# Altium schematic sheet Main MCU and peripheral.SchDoc
size C
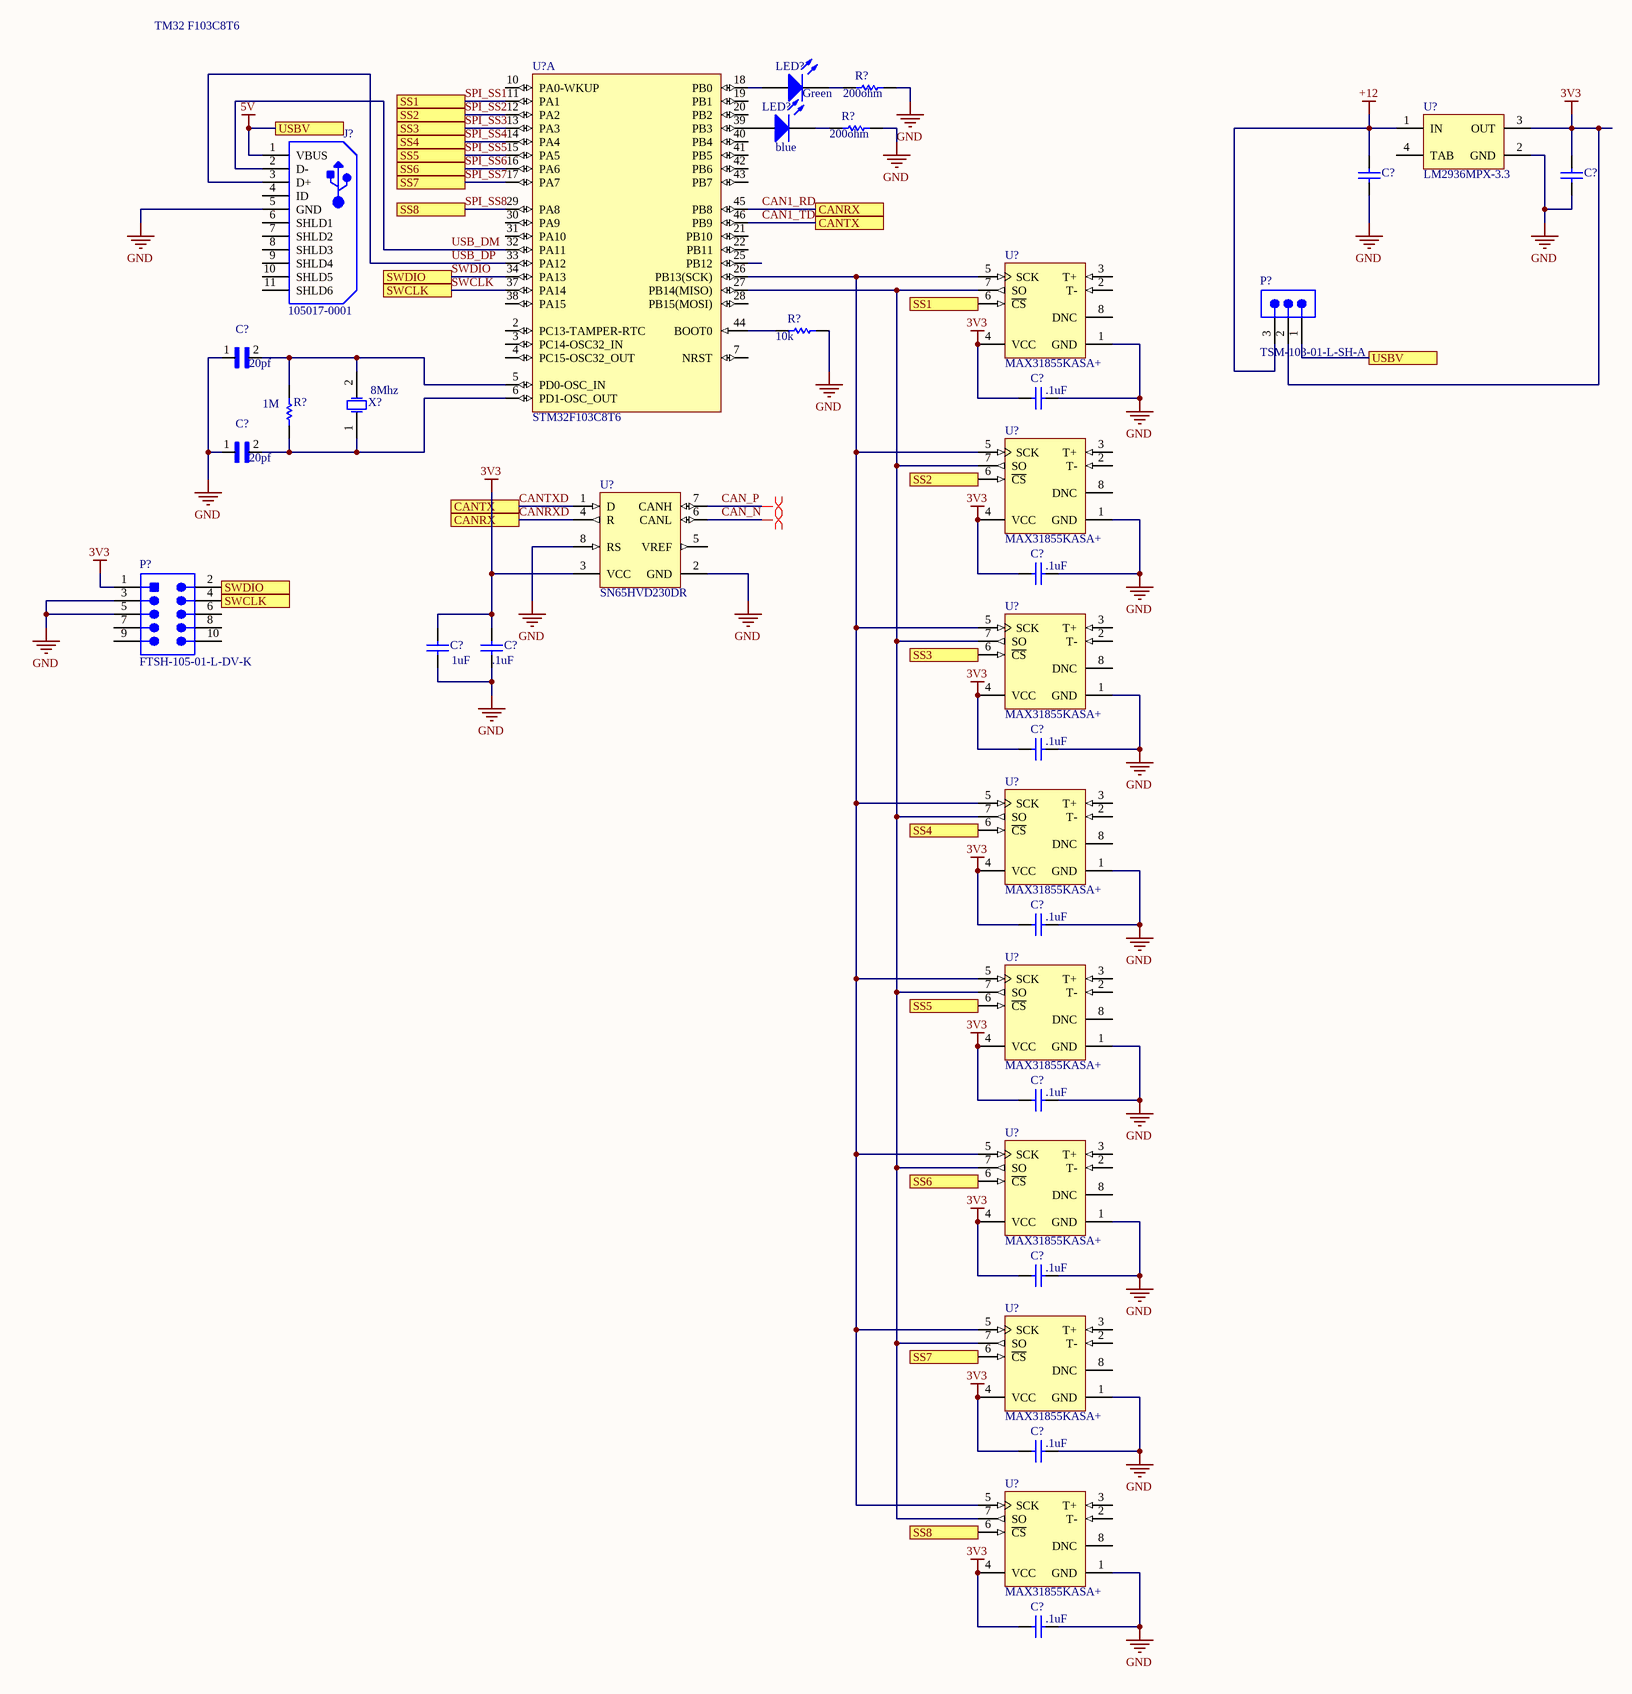
[diagram p0: Main MCU and peripheral.SchDoc]

## Parts
(Parts that share a designator on the sheet are numbered #1, #2 ... from top to bottom, then left to right.)
C?#1  C0603C104M4RACTU  [CAPC1608X87X35ML15T15]  (value not drawn)
C?#2  C0805C106K4PACTU  [CAPC2013X140X50LL20T25]  (value not drawn)
C?#3  06036A180JAT2A  [*CAPC1608X90N]  (value not drawn)
C?#4  C0603C104K9PAC7867  [CAPC1608X90X35ML10T15]  (value not drawn)
C?#5  06036A180JAT2A  [*CAPC1608X90N]  (value not drawn)
C?#6  C0603C104K9PAC7867  [CAPC1608X90X35ML10T15]  (value not drawn)
C?#7  CAP 1uF 6.3V 0805(2012)  [CAPC0805(2012)145_N]  (value not drawn)
C?#8  CAP 100nF 6.3V 0805(2012)  [CAPC0805(2012)100_N]  (value not drawn)
C?#9  C0603C104K9PAC7867  [CAPC1608X90X35ML10T15]  (value not drawn)
C?#10  C0603C104K9PAC7867  [CAPC1608X90X35ML10T15]  (value not drawn)
C?#11  C0603C104K9PAC7867  [CAPC1608X90X35ML10T15]  (value not drawn)
C?#12  C0603C104K9PAC7867  [CAPC1608X90X35ML10T15]  (value not drawn)
C?#13  C0603C104K9PAC7867  [CAPC1608X90X35ML10T15]  (value not drawn)
C?#14  C0603C104K9PAC7867  [CAPC1608X90X35ML10T15]  (value not drawn)
J?  105017-0001  [USB-MICRO-B_V]
LED?#1  150120GS75000  [1206_A]  (value not drawn)
LED?#2  150120BS75000  [1206_A]  (value not drawn)
P?#1  TSM-103-01-L-SH-A  [SMTC-TSM-103-01-X-SH-A]
P?#2  FTSH-105-01-L-DV-K  [SMTC-FTSH-105-01-L-DV-K_V]
R?#1  AC0603FR-07200RL  [RESC1608X55X25ML10T15]  (value not drawn)
R?#2  AC0603FR-07200RL  [RESC1608X55X25ML10T15]  (value not drawn)
R?#3  RC0805FR-0710KL  [RESC2013X60X35NL10T20]  (value not drawn)
R?#4  RC0603FR-071ML  [RESC1608X55X25LL10T15]  (value not drawn)
U?#1  STM32F103C8T6  [STM-LQFP48_L]  (part A of 2)
U?#2  LM2936MPX-3.3  [MP04A_N]
U?#3  MAX31855KASA+  [MAXM-S8+4_M]
U?#4  MAX31855KASA+  [MAXM-S8+4_M]
U?#5  SN65HVD230DR  [D0008A_L]
U?#6  MAX31855KASA+  [MAXM-S8+4_M]
U?#7  MAX31855KASA+  [MAXM-S8+4_M]
U?#8  MAX31855KASA+  [MAXM-S8+4_M]
U?#9  MAX31855KASA+  [MAXM-S8+4_M]
U?#10  MAX31855KASA+  [MAXM-S8+4_M]
U?#11  MAX31855KASA+  [MAXM-S8+4_M]
X?  ABM3-8.000MHZ-D2Y-T  [ABRA-ABM3-2_V]  (value not drawn)

## Ports
CANRX, CANTX, SS1, SS2, SS3, SS4, SS5, SS6, SS7, SS8, SWCLK, SWDIO, USBV

## Nets
3V3: C?#2.2 C?#4.1 C?#6.1 C?#7.2 C?#8.2 C?#9.1 C?#10.1 C?#11.1 C?#12.1 C?#13.1 C?#14.1 P?#1.2 P?#2.1 U?#2.3(OUT) U?#3.4(VCC) U?#4.4(VCC) U?#5.3(VCC) U?#6.4(VCC) U?#7.4(VCC) U?#8.4(VCC) U?#9.4(VCC) U?#10.4(VCC) U?#11.4(VCC)
5V: J?.1(VBUS) P?#1.1 ; port USBV
+12: C?#1.2 P?#1.3 U?#2.1(IN)
GND: C?#1.1 C?#2.1 C?#3.1 C?#4.2 C?#5.1 C?#6.2 C?#7.1 C?#8.1 C?#9.2 C?#10.2 C?#11.2 C?#12.2 C?#13.2 C?#14.2 J?.5(GND) P?#2.3 P?#2.5 R?#1.2 R?#2.2 R?#3.2 U?#2.2(GND) U?#3.1(GND) U?#4.1(GND) U?#5.2(GND) U?#5.8(RS) U?#6.1(GND) U?#7.1(GND) U?#8.1(GND) U?#9.1(GND) U?#10.1(GND) U?#11.1(GND)
CAN1_RD: U?#1.45(PB8) U?#5.4(R) ; port CANRX  [also labelled CANRXD]
CAN1_TD: U?#1.46(PB9) U?#5.1(D) ; port CANTX  [also labelled CANTXD]
CAN_N: U?#5.6(CANL)
CAN_P: U?#5.7(CANH)
SPI_SS1: U?#1.11(PA1) U?#3.6(~{CS}) ; port SS1
SPI_SS2: U?#1.12(PA2) U?#4.6(~{CS}) ; port SS2
SPI_SS3: U?#1.13(PA3) U?#6.6(~{CS}) ; port SS3
SPI_SS4: U?#1.14(PA4) U?#7.6(~{CS}) ; port SS4
SPI_SS5: U?#1.15(PA5) U?#8.6(~{CS}) ; port SS5
SPI_SS6: U?#1.16(PA6) U?#9.6(~{CS}) ; port SS6
SPI_SS7: U?#1.17(PA7) U?#10.6(~{CS}) ; port SS7
SPI_SS8: U?#1.29(PA8) U?#11.6(~{CS}) ; port SS8
SWCLK: P?#2.4 U?#1.37(PA14) ; port SWCLK
SWDIO: P?#2.2 U?#1.34(PA13) ; port SWDIO
USB_DM: J?.2(D-) U?#1.32(PA11)
USB_DP: J?.3(D+) U?#1.33(PA12)
NetC?#3_2: C?#3.2 R?#4.2 U?#1.5(PD0-OSC_IN) X?.2(X2)
NetC?#5_2: C?#5.2 R?#4.1 U?#1.6(PD1-OSC_OUT) X?.1(X1)
NetLED?#1_1: LED?#1.1(K) R?#1.1
NetLED?#1_2: LED?#1.2(A) U?#1.18(PB0)
NetLED?#2_1: LED?#2.1(K) R?#2.1
NetLED?#2_2: LED?#2.2(A) U?#1.39(PB3)
NetR?#3_1: R?#3.1 U?#1.44(BOOT0)
NetU?#1_26: U?#1.26(PB13(SCK)) U?#3.5(SCK) U?#4.5(SCK) U?#6.5(SCK) U?#7.5(SCK) U?#8.5(SCK) U?#9.5(SCK) U?#10.5(SCK) U?#11.5(SCK)
NetU?#1_27: U?#1.27(PB14(MISO)) U?#3.7(SO) U?#4.7(SO) U?#6.7(SO) U?#7.7(SO) U?#8.7(SO) U?#9.7(SO) U?#10.7(SO) U?#11.7(SO)

Not connected (* = marked no-connect by the designer): J? 4(ID) 6(SHLD1) 7(SHLD2) 8(SHLD3) 9(SHLD4) 10(SHLD5) 11(SHLD6); P?#2 6 7 8 9 10; U?#1 2(PC13-TAMPER-RTC) 3(PC14-OSC32_IN) 4(PC15-OSC32_OUT) 7(NRST) 10(PA0-WKUP) 19(PB1) 20(PB2) 21(PB10) 22(PB11) 25(PB12) 28(PB15(MOSI)) 30(PA9) 31(PA10) 38(PA15) 40(PB4) 41(PB5) 42(PB6) 43(PB7); U?#2 4(TAB); U?#3 2(T-) 3(T+) 8(DNC); U?#4 2(T-) 3(T+) 8(DNC); U?#5 5(VREF); U?#6 2(T-) 3(T+) 8(DNC); U?#7 2(T-) 3(T+) 8(DNC); U?#8 2(T-) 3(T+) 8(DNC); U?#9 2(T-) 3(T+) 8(DNC); U?#10 2(T-) 3(T+) 8(DNC); U?#11 2(T-) 3(T+) 8(DNC)

## Layout directives
differential pair: CAN_N, CAN_P

## Notes on the sheet
- TM32 F103C8T6
- (near LED?#2) blue
- (near LED?#1) Green
- (near R?#2) 200ohm
- (near R?#1) 200ohm
- (near R?#3) 10k
- (near C?#3) 20pf
- (near R?#4) 1M
- (near X?) 8Mhz
- (near C?#4) .1uF
- (near C?#5) 20pf
- (near C?#6) .1uF
- (near C?#7) 1uF
- (near C?#8) .1uF
- (near C?#9) .1uF
- (near C?#10) .1uF
- (near C?#11) .1uF
- (near C?#12) .1uF
- (near C?#13) .1uF
- (near C?#14) .1uF
- Title
- Size:
- Date:
- File:
- C
- Number:
- Time:
- Revision:
- Sheet
- of

## Library data of the parts
C?#1 = CMP-2006-03067-1: .1uF, 16V; Manufacturer: Kemet; Part Number: C0603C104M4RACTU
C?#2 = CMP-2007-03242-1: 10uF, 16V; Manufacturer: Kemet; Part Number: C0805C106K4PACTU
C?#3 C?#5 = 06036A180JAT2A: / 18pF Â±5% 6.3V Ceramic Capacitor C0G, NP0 0603 _1608 Metric_ /; MF: AVX; SnapEDA_Link: https://www.snapeda.com/parts/06036A180JAT2A/AVX/view-part/606100/?ref=snap; MP: 06036A180JAT2A; Digi-Key_Part_Number: 478-11838-1-ND; Package: 1608 AVX; Digi-Key_Purchase_URL: https://www.digikey.com/product-detail/en/avx-corporation/06036A180JAT2A/478-11838-1-ND/8573474?utm_source=snapeda&utm_medium=aggregator&utm_campaign=symbol; Value: *
C?#4 C?#6 C?#9-C?#14 = CMP-2000-04945-1: Chip Capacitor, 22 pF, +/- 5%, 50 V, -55 to 125 degC, 0603 (1608 Metric), RoHS, Tape and Reel; Manufacturer: Murata; Capacitance: 22pF; Rated Voltage: 50V; Dielectric: C0G; Manufacturer URL: http://www.murata.com/; Datasheet Version: Jul-06; Package Reference: 603; Tolerance (%): ±5%; Case Size/Dimension: 0603; Package Description: 2-Pin Surface Mount Device, Body 1.6 x 0.8 mm; Datasheet URL: https://datasheet.ciiva.com/11786/0900766b807a1cab-11786398.pdf
C?#7 = CMP-1036-04731-1: CAP 1uF 6.3V ±10% 0805 (2012 Metric) Thickness 1.45mm SMD; Case-Metric: 2012; Case-EIA: 0805; Tolerance: Â±10%; Max Thickness: 1.45 mm; Technology: SMT; Value: 1uF; Rated Voltage: 6.3 V
C?#8 = CMP-1036-04391-1: CAP 100nF 6.3V ±10% 0805 (2012 Metric) Thickness 1mm SMD; Case-EIA: 0805; Case-Metric: 2012; Tolerance: Â±10%; Rated Voltage: 6.3 V; Technology: SMT; Value: 100nF; Max Thickness: 1 mm
J? = CMP-2000-05827-1: Micro-USB B Receptacle, Right Angle, Bottom Mount, Surface Mount, with Solder Tabs, -30 to 85 degC, 5-Pin USB, RoHS, Tape and Reel; Manufacturer: Molex; Featured Product: Micro-USBConnectorsUSBConnectors; Other Names: WM1399DKR; Package Version: Rev. F, 12/2012; Number of Contacts: 5; Connector Type: USB-microB; Catalog Drawings: 1050170001; 3D Model: 105017-0001.stp; Mating Products: WM17145-ND-CABLEMICROUSBBTOSTDA1.0MWM17147-ND-CABLEMICROUSBBTOSTDA2.0MWM17146-ND-CABLEMICROUSBBTOSTDA1.5M; PCN Assembly/Origin: ResinSupplier21/Oct/2015; Voltage - Max: 30V; Online Catalog: Molex-MicroUSB; Manufacturer URL: http://www.molex.com/; Package Description: 5-Leads USB, Micro B, Body 7.5 x 5 mm, Pitch 0.65 mm; Datasheet URL: http://www.molex.com/elqNow/elqRedir.htm?ref=http://www.molex.com/webdocs/datasheets/pdf/en-us/1050170001_IO_CONNECTORS.pdf; Ingress Protection: -; Datasheet Version: 03/2016; Mounting Type: BoardCutout,SurfaceMount,RightAngle; Circuits: 5; Standard Package: 1; Package Reference: MICRO-B; Package URL: http://www.molex.com/pdm_docs/sd/1050170001_sd.pdf; Category: Connectors,Interconnects; Series: -; RoHS Information: 1050170001CertofCompliance; Features: Shielded,SolderRetention; Family: USB,DVI,HDMIConnectors; Specifications: -; Gender: Receptacle; Packaging: Digi-Reel®; Mounting Technology: SurfaceMount
LED?#1 = CMP-1426-00014-1: SMD mono-color Chip LED, WL-SMCW, Green; Manufacturer: Wuerth Elektronik; PackageReference: 1206_A; PartNumber: 150120GS75000; ComponentLink1Description: Manufacturer URL; ComponentLink2URL: http://katalog.we-online.com/led/datasheet/150120GS75000.pdf; ComponentLink2Description: Datasheet; Color: Green; ComponentLink1URL: http://www.we-online.com
LED?#2 = CMP-1426-00015-1: SMD mono-color Chip LED, WL-SMCW, Blue; Manufacturer: Wuerth Elektronik; ComponentLink2Description: Datasheet; ComponentLink1URL: http://www.we-online.com; PartNumber: 150120BS75000; ComponentLink1Description: Manufacturer URL; ComponentLink2URL: http://katalog.we-online.com/led/datasheet/150120BS75000.pdf; PackageReference: 1206_A; Color: Blue
P?#1 = CMP-1024-00213-1: 0.025" SQ Post Header, Surface Mount, Horizontal, -55 to 125 degC, 2.54 mm Pitch, 3-Pin, Male, RoHS; Manufacturer: Samtec; Pitch: 2.54 mm; ComponentLink3Description: Package Specification; ComponentLink1URL: http://www.samtec.com; PackageReference: TSM-103-01-X-SH-A; PackageDescription: Terminal Strip Single Surface Mount; Mounting Technology: Surface Mount; PartNumber: TSM-103-01-L-SH-A; Temperature Range: -55 to 125 degC; DatasheetVersion: F-214; Orientation: Horizontal; ComponentLink3URL: http://www.samtec.com/documents/webfiles/cpdf/TSM-1XX-XX-XXX-SH-XX-XXX-XX-MKT1.pdf; RoHS: True; ComponentLink2URL: http://www.samtec.com/documents/webfiles/pdf/TSM.PDF; ComponentLink1Description: Manufacturer URL; PackageVersion: CD, 7/1991; ComponentLink2Description: Datasheet
P?#2 = CMP-2000-05353-1: Male Header, Pitch 1.27 mm, 2 x 5 Position, Height 6.25 mm; Manufacturer: Samtec; Pitch: 0.050"(1.27mm); Other Names: Q3937619; Number of Positions: 10; Mating Products: SFMC-105-L2-S-D-TR-ND / -CONN.05"SURFACE10POSSMT / FLE-105-01-G-DV-TR-ND / -CONNSKT1.27MM10POSDUALSMD / FLE-105-01-G-DV-A-P-ND / -CONNSKT1.27MM10POSDUALSMD / FLE-105-01-G-DV-A-ND / -CONNSKT1.27MM10POSDUALSMD / CLP-105-02-G-D-P-TR-ND / -CONNRCPT10POSDUAL.05"SMD / SAM1155-05-ND / -CONNRCPT10POSDUAL.05"SMD / SAM1154-05-ND / -CONNRCPT10POSDUAL.05"SMD / SAM1153-05-ND / -CONNRCPT10POSDUAL.05"SMD / SAM1226-05-ND / -CONNRCPT.05"10POSDUALSMD; Number of Positions Loaded: All; Connector Type: Header,Unshrouded; Product Training Modules: Board-to-BoardConnectors; Datasheet Version: Rev. ET, 10/1995; Number of Rows: 2; Standard Package: 1; Package Description: Male Header, Pitch 1.27 mm, 2 x 5 Position, Height 5.97 mm, Tail Length 4.32 mm; Contact Finish Thickness: 10µin(0.25µm); Series: FTSH; Termination: Solder; Contact Type: MalePin; Color: Black; Package Reference: FTSH-105-01-L-DV-K; Family: RectangularConnectors-Headers,MalePins; Package URL: http://suddendocs.samtec.com/prints/ftsh-1xx-xx-xxx-dv-xxx-footprint.pdf; Packaging: Tube; Mounting Type: SurfaceMount; Category: Connectors,Interconnects; Datasheet URL: http://suddendocs.samtec.com/prints/ftsh-1xx-xx-xxx-dv-xxx-mkt.pdf; Row Spacing: 0.050"(1.27mm); Manufacturer URL: http://www.samtec.com/; Contact Mating Length: 0.120"(3.05mm); Contact Finish: Gold
R?#1 = CMP-2000-04830-1: 603; Manufacturer: Yageo; Part Number: AC0603FR-07200RL
R?#2 = CMP-2000-04830-1: Manufacturer: Yageo; Part Number: AC0603FR-07200RL
R?#3 = CMP-1659-00013-4: Chip Resistor, 10 KOhm, +/- 1%, 0.125 W, -55 to 155 degC, 0805 (2012 Metric), RoHS, Tape and Reel; Manufacturer: Yageo; Voltage Rating: 150 V; Mount: Surface Mount; ComponentLink1Description: Manufacturer URL; ComponentLink2URL: http://www.yageo.com/documents/recent/PYu-RC_Group_51_RoHS_L_04.pdf; Pins: 2; Length: 2 mm; Min Operating Temperature: -55 degC; Height: 0.5 mm; Mounting Technology: Surface Mount; RoHSCompliant: true; REACH SVHC: No SVHC; ComponentLink1URL: http://www.yageo.com/; Max Operating Temperature: 155 degC; PackageReference: 0805; DatasheetVersion: Rev. 4, 02/2016; Package Quantity: 5000; Packaging: Tape and Reel; ComponentLink2Description: Datasheet; PackageDescription: 2-Pin Surface Mounted Device, Body 2 x 1.25 mm
R?#4 = CMP-1659-00056-1: Chip Resistor, 1 MOhm, +/- 1%, 100 mW, -55 to 155 degC, 0603 (1608 Metric), RoHS, Tape and Reel; Voltage Rating (DC): 25 V; Tolerance: 20%; Case\Package: Radial; Capacitance: 1 mF; Min Operating Temperature: -40 degC; PackageDescription: 2-Pin Surface Mount Device, Body 1.6 x 0.8 mm; ComponentLink1Description: Manufacturer URL; Radiation Hardening: No; DatasheetVersion: Rev. 4, 02/2016; REACH SVHC: No SVHC; Length: 20 mm; Max Operating Temperature: 85 degC; Diameter: 10 mm; Packaging: Bulk; Package Quantity: 200; PackageReference: 0603; Mount: Through Hole; ComponentLink1URL: http://www.yageo.com/; ComponentLink2URL: http://www.yageo.com/documents/recent/PYu-RC_Group_51_RoHS_L_04.pdf; ComponentLink2Description: Datasheet; Width: 0 inch; Lead Pitch: 5 mm; RoHSCompliant: true; Voltage Rating: 25 V; Height: 20 mm
U?#1 = CMP-0237-00215-3: ARM Cortex-M3 32-bit MCU, 64 KB Flash, 20 KB Internal RAM, 37 I/Os, 48-pin LQFP, -40 to 85 degC, Tray; Supply Voltage(Vcc) min (V): 2; Internal RAM Size (kB): 20; FLASH Size (Prog) (kB): 64; A/D Converter: 2x12-bit (10 Channel); I/Os (High Current): 37; Operating Frequency(F) (Processor speed) (MHz): 72; Core: ARM Cortex-M3; ComponentLink3Description: Package Specification; Mounting Technology: Surface Mount; PartNumber: STM32F103C8T6; PackageReference: LQFP48; Packing: Tray; ComponentLink3URL: http://www.st.com/st-web-ui/static/active/en/resource/technical/document/datasheet/DM00058181.pdf; DatasheetVersion: Rev. 16; ComponentLink1URL: http://www.st.com/web/en/home.html; PackageVersion: Rev. 6, 06/2013; ComponentLink2URL: http://www.st.com/st-web-ui/static/active/en/resource/technical/document/datasheet/CD00161566.pdf; ComponentLink1Description: Manufacturer URL; ComponentLink2Description: Datasheet; PackageDescription: 48-Pin Low Profile Quad Flat Package, 7 x 7 mm Body, 0.5 mm Pitch
U?#2 = CMP-0062-01666-2: Ultra-Low Quiescent Current LDO Voltage Regulator, 4-pin SOT-223; Manufacturer: National Semiconductor; PackageTopMarking: XYTT*KABA; CompType: LDO IC; PowerWise: N; ComponentLink3URL: http://www.national.com/packaging/folders/mp04a.html; PackageVersion: revB, Apr-2003; ComponentLink2URL: http://www.national.com/pf/LM/LM2936.html; ComponentLink3Description: MP04A Package Page; PinCount: 4; Code_IPC: SOT223-4; RevisionNote: Component URLs added; ComponentLink2Description: LM2936 Web Page; Code_JEDEC: TO-261-AA; PackageReference: MP04A; PackageDescription: Molded SOT-223, 6.50 x 3.56 x 1.6mm Body, 4 Lead, 2.3mm Pitch; ComponentLink1URL: http://www.national.com/ds/LM/LM2936.pdf; DatasheetVersion: Oct-2006; RoHS: N; ComponentLink1Description: LM2936 Datasheet
U?#3 U?#4 U?#6-U?#11 = CMP-0253-00403-1: Cold Junction Compensated Thermocouple to Digital Converter, 14 Bits Temperature Resolution, -40 to 125 degC, 8-Pin SOIC (S8+4), Pb-Free; Parasite Pwr.: No; Functions: Thermocouple-to-Digital Converter; Interface: SPI; ComponentLink1URL: http://www.maximintegrated.com/; PartNumber: MAX31855KASA+; Generic Part Number: MAX31855; Code_JEDEC: MS-012; DatasheetVersion: Rev. 2; PackageReference: S8+4; ComponentLink1Description: Manufacturer URL; ComponentLink3Description: Package Specification; PackageVersion: Rev. D, 10/2012; PackageDescription: 8-Pin Small-Outline IC, Narrow, Body 3.9 x 4.9 mm, Pitch 1.27 mm; ComponentLink2URL: http://datasheets.maximintegrated.com/en/ds/MAX31855.pdf; ComponentLink2Description: Datasheet; ComponentLink3URL: http://pdfserv.maximintegrated.com/package_dwgs/21-0041.PDF; Mounting Technology: Surface Mount
U?#5 = CMP-0315-00015-2: 3.3V CAN Transceiver with Standby Mode, 17 mA, -40 to 85 degC, 8-pin SOIC (D), Green (RoHS & no Sb/Br); Manufacturer: Texas Instruments; Rating: Catalog; Transient Pulse Protection(V): -25 to 25; Receivers Per Package: 1; ICC(Max)(mA): 17; Supply Voltage(s)(V): 3.3; Low Power Mode: Standby; Mounting Technology: Surface Mount; PackageReference: D0008A; Footprint: PCA82C250; ComponentLink1URL: http://www.ti.com/general/docs/lit/getliterature.tsp?genericPartNumber=SN65HVD230&fileType=pdf; Code_JEDEC: MS-012AA; ComponentLink1Description: Datasheet; Eco-Plan: Green (RoHS & no Sb/Br); PartNumber: SN65HVD230DR; PackageDescription: 8-Pin Plastic Small Outline Integrated Circuit, 4.9 x 3.9 mm, Pitch 1.27 mm Pitch; Isolated: No; DatasheetVersion: SLOS346K; PackageVersion: revM, Jun-2011; SubFamily: CAN; Drivers Per Package: 1
X? = CMP-2000-05033-1: Miniature Ceramic Crystal, 8 MHz, -40 to 85 degC, 2-Pin SMD, RoHS, Tape and Reel; Manufacturer: ABRACON; Case Length: 5mm; Case Width: 3.2mm; Case Height: 1.3mm; Load Capacitance: 18pF; Frequency: 8MHz; Frequency Stability: 30PPM; ESR: 140Ohms; Tolerance: 20PPM; Type: MiniatureCeramicCrystal; Factory Pack Quantity: 1000; Package / Case: 5mmx3.2mm; Mounting Style: SMD/SMT; Manufacturer URL: http://www.abracon.com/; RoHS: Details; Dimensions: 3.2mmWx5mmLx1.3mmH; Datasheet URL: http://www.farnell.com/datasheets/1754353.pdf; Brand: ABRACON; Packaging: Reel; Product Category: Crystals; Package Description: 2-Pin Surface Mount Device, Body 5 x 3.2 mm; Package URL: http://www.abracon.com/Support/PackageDrawing/Resonators/ABM3.PDF; Operating Temperature Range: -40Cto+85C; Termination Style: SMD/SMT; Datasheet Version: Sep-13; Series: ABM3; Package Reference: ABM3-2